# EAGLE design deska (EAGLE 9.5.0)
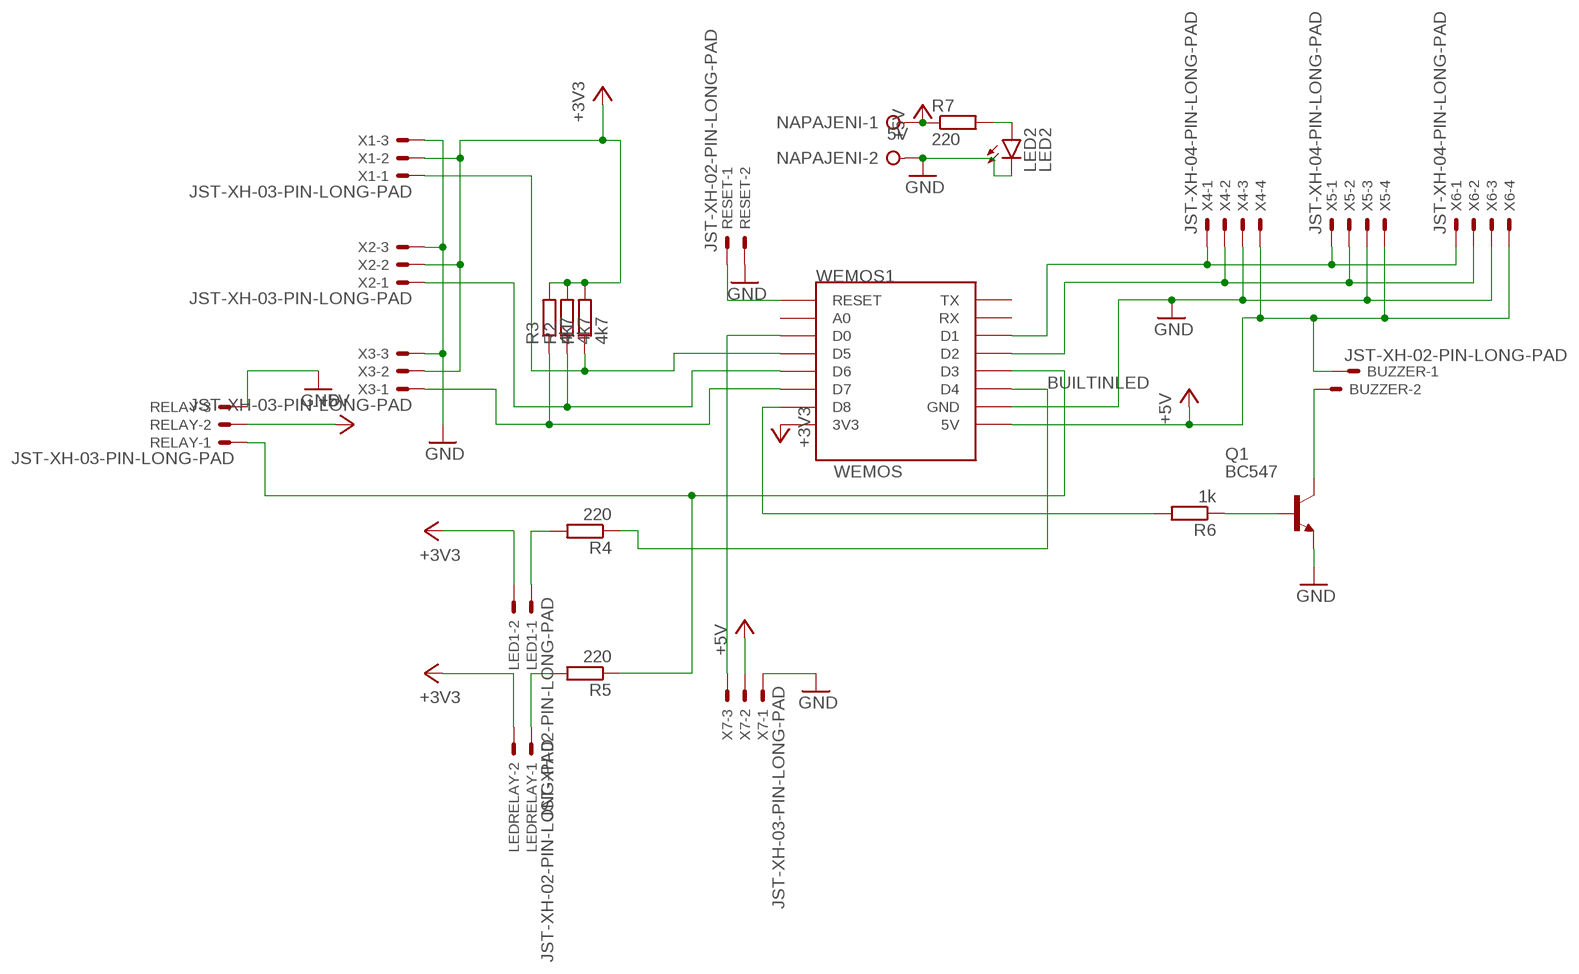
[diagram p0: schematic, sheet 1]

## Parts
BUZZER  JST-XH-02-PIN-LONG-PAD  [JST-XH-02-PACKAGE-LONG-PAD]
LED1  JST-XH-02-PIN-LONG-PAD  [JST-XH-02-PACKAGE-LONG-PAD]
LED2  LED2  LED3MM  [LED3MM]
LEDRELAY  JST-XH-02-PIN-LONG-PAD  [JST-XH-02-PACKAGE-LONG-PAD]
NAPAJENI  5V  W237-02P  [W237-132]
Q1  BC547  [TO92]
R1  4k7  R-EU_0207/7  [0207/7]
R2  4k7  R-EU_0207/7  [0207/7]
R3  4k7  R-EU_0207/7  [0207/7]
R4  220  R-EU_0207/7  [0207/7]
R5  220  R-EU_0207/7  [0207/7]
R6  1k  R-EU_0207/7  [0207/7]
R7  220  R-EU_0207/7  [0207/7]
RELAY  JST-XH-03-PIN-LONG-PAD  [JST-XH-03-PACKAGE-LONG-PAD]
RESET  JST-XH-02-PIN-LONG-PAD  [JST-XH-02-PACKAGE-LONG-PAD]
WEMOS1  WEMOS  WEMOS-D1-MINI  [WEMOS-D1-MINI]
X1  JST-XH-03-PIN-LONG-PAD  [JST-XH-03-PACKAGE-LONG-PAD]
X2  JST-XH-03-PIN-LONG-PAD  [JST-XH-03-PACKAGE-LONG-PAD]
X3  JST-XH-03-PIN-LONG-PAD  [JST-XH-03-PACKAGE-LONG-PAD]
X4  JST-XH-04-PIN-LONG-PAD  [JST-XH-04-PACKAGE-LONG-PAD]
X5  JST-XH-04-PIN-LONG-PAD  [JST-XH-04-PACKAGE-LONG-PAD]
X6  JST-XH-04-PIN-LONG-PAD  [JST-XH-04-PACKAGE-LONG-PAD]
X7  JST-XH-03-PIN-LONG-PAD  [JST-XH-03-PACKAGE-LONG-PAD]

## Nets
+3V3: LED1.2 LEDRELAY.2 R1.2 R2.2 R3.2 WEMOS1.3V3 X1.2 X2.2 X3.2
+5V: BUZZER.1 NAPAJENI.1 R7.1 RELAY.2 WEMOS1.5V X4.4 X5.4 X6.4 X7.2
BUILTINLED: R4.1 WEMOS1.D4
GND: LED2.K(C) NAPAJENI.2 Q1.1(E) RELAY.3 RESET.2 WEMOS1.GND X1.3 X2.3 X3.3 X4.3 X5.3 X6.3 X7.1
N$1: R1.1 WEMOS1.D5 X1.1
N$2: LEDRELAY.1 R5.2
N$4: LED2.A R7.2
N$5: RESET.1 WEMOS1.RESET
N$6: LED1.1 R4.2
N$7: Q1.2(B) R6.1
N$8: R6.2 WEMOS1.D8
N$9: R3.1 WEMOS1.D7 X3.1
N$10: WEMOS1.D0 X7.3
N$11: WEMOS1.D1 X4.1 X5.1 X6.1
N$12: WEMOS1.D2 X4.2 X5.2 X6.2
N$14: R5.1 RELAY.1 WEMOS1.D3
N$15: BUZZER.2 Q1.3(C)
N$19: R2.1 WEMOS1.D6 X2.1
Unconnected: WEMOS1.A0 WEMOS1.RX WEMOS1.TX

## Library data of the parts
BUZZER LED1 LEDRELAY RESET = Rembrandt Electronics - JST XH Connectors v1-0:JST-XH-02-PIN: JST XH Connector 2 Pin Wire to board connector. Pitch: 2,54 mm, (0.100") Number of pins: 2 Created by Rembrandt Electronics www.rembrandtelectronics.com
LED2 = led:LED: LED OSRAM: - CHIPLED LG R971, LG N971, LY N971, LG Q971, LY Q971, LO R971, LY R971 LH N974, LH R974 LS Q976, LO Q976, LY Q976 LO Q996 - Hyper CHIPLED LW Q18S LB Q993, LB Q99A, LB R99A - SideLED LS A670, LO A670, LY A670, LG A670, LP A670 LB A673, LV A673, LT A673, LW A673 LH A674 LY A675 LS A676, LA A676, LO A676, LY A676, LW A676 LS A679, LY A679, LG A679 - Hyper Micro SIDELED® LS Y876, LA Y876, LO Y876, LY Y876 LT Y87S - SmartLED LW L88C, LW L88S LB L89C, LB L89S, LG L890 LS L89K, LO L89K, LY L89K LS L896, LA L896, LO L896, LY L896 - TOPLED LS T670, LO T670, LY T670, LG T670, LP T670 LSG T670, LSP T670, LSY T670, LOP T670, LYG T670 LG T671, LOG T671, LSG T671 LB T673, LV T673, LT T673, LW T673 LH T674 LS T676, LA T676, LO T676, LY T676, LB T676, LH T676, LSB T676, LW T676 LB T67C, LV T67C, LT T67C, LS T67K, LO T67K, LY T67K, LW E67C LS E67B, LA E67B, LO E67B, LY E67B, LB E67C, LV E67C, LT E67C LW T67C LS T679, LY T679, LG T679 LS T770, LO T770, LY T770, LG T770, LP T770 LB T773, LV T773, LT T773, LW T773 LH T774 LS E675, LA E675, LY E675, LS T675 LS T776, LA T776, LO T776, LY T776, LB T776 LHGB T686 LT T68C, LB T68C - Hyper Mini TOPLED® LB M676 - Mini TOPLED Santana® LG M470 LS M47K, LO M47K, LY M47K Source: http://www.osram.convergy.de LUXEON: - LUMILED® LXK2-PW12-R00, LXK2-PW12-S00, LXK2-PW14-U00, LXK2-PW14-V00 LXK2-PM12-R00, LXK2-PM12-S00, LXK2-PM14-U00 LXK2-PE12-Q00, LXK2-PE12-R00, LXK2-PE12-S00, LXK2-PE14-T00, LXK2-PE14-U00 LXK2-PB12-K00, LXK2-PB12-L00, LXK2-PB12-M00, LXK2-PB14-N00, LXK2-PB14-P00, LXK2-PB14-Q00 LXK2-PR12-L00, LXK2-PR12-M00, LXK2-PR14-Q00, LXK2-PR14-R00 LXK2-PD12-Q00, LXK2-PD12-R00, LXK2-PD12-S00 LXK2-PH12-R00, LXK2-PH12-S00 LXK2-PL12-P00, LXK2-PL12-Q00, LXK2-PL12-R00 Source: www.luxeon.com KINGBRIGHT: KA-3528ASYC Source: www.kingbright.com
NAPAJENI = con-wago-508:W237-02P: WAGO SREW CLAMP; OC_FARNELL: unknown; OC_NEWARK: unknown
Q1 = transistor-npn:BC547*: NPN Transistor
R1-R7 = rcl:R-EU_: RESISTOR, European symbol
RELAY X1-X3 X7 = Rembrandt Electronics - JST XH Connectors v1-0:JST-XH-03-PIN: JST XH Connector 2 Pin Wire to board connector. Pitch: 2,54 mm, (0.100") Number of pins: 3 Created by Rembrandt Electronics www.rembrandtelectronics.com
WEMOS1 = wemos:WEMOS-D1-MINI: WeMos.cc D1 mini ESP8266 module
X4-X6 = Rembrandt Electronics - JST XH Connectors v1-0:JST-XH-04-PIN: JST XH Connector 2 Pin Wire to board connector. Pitch: 2,54 mm, (0.100") Number of pins: 4 Created by Rembrandt Electronics www.rembrandtelectronics.com

## Board
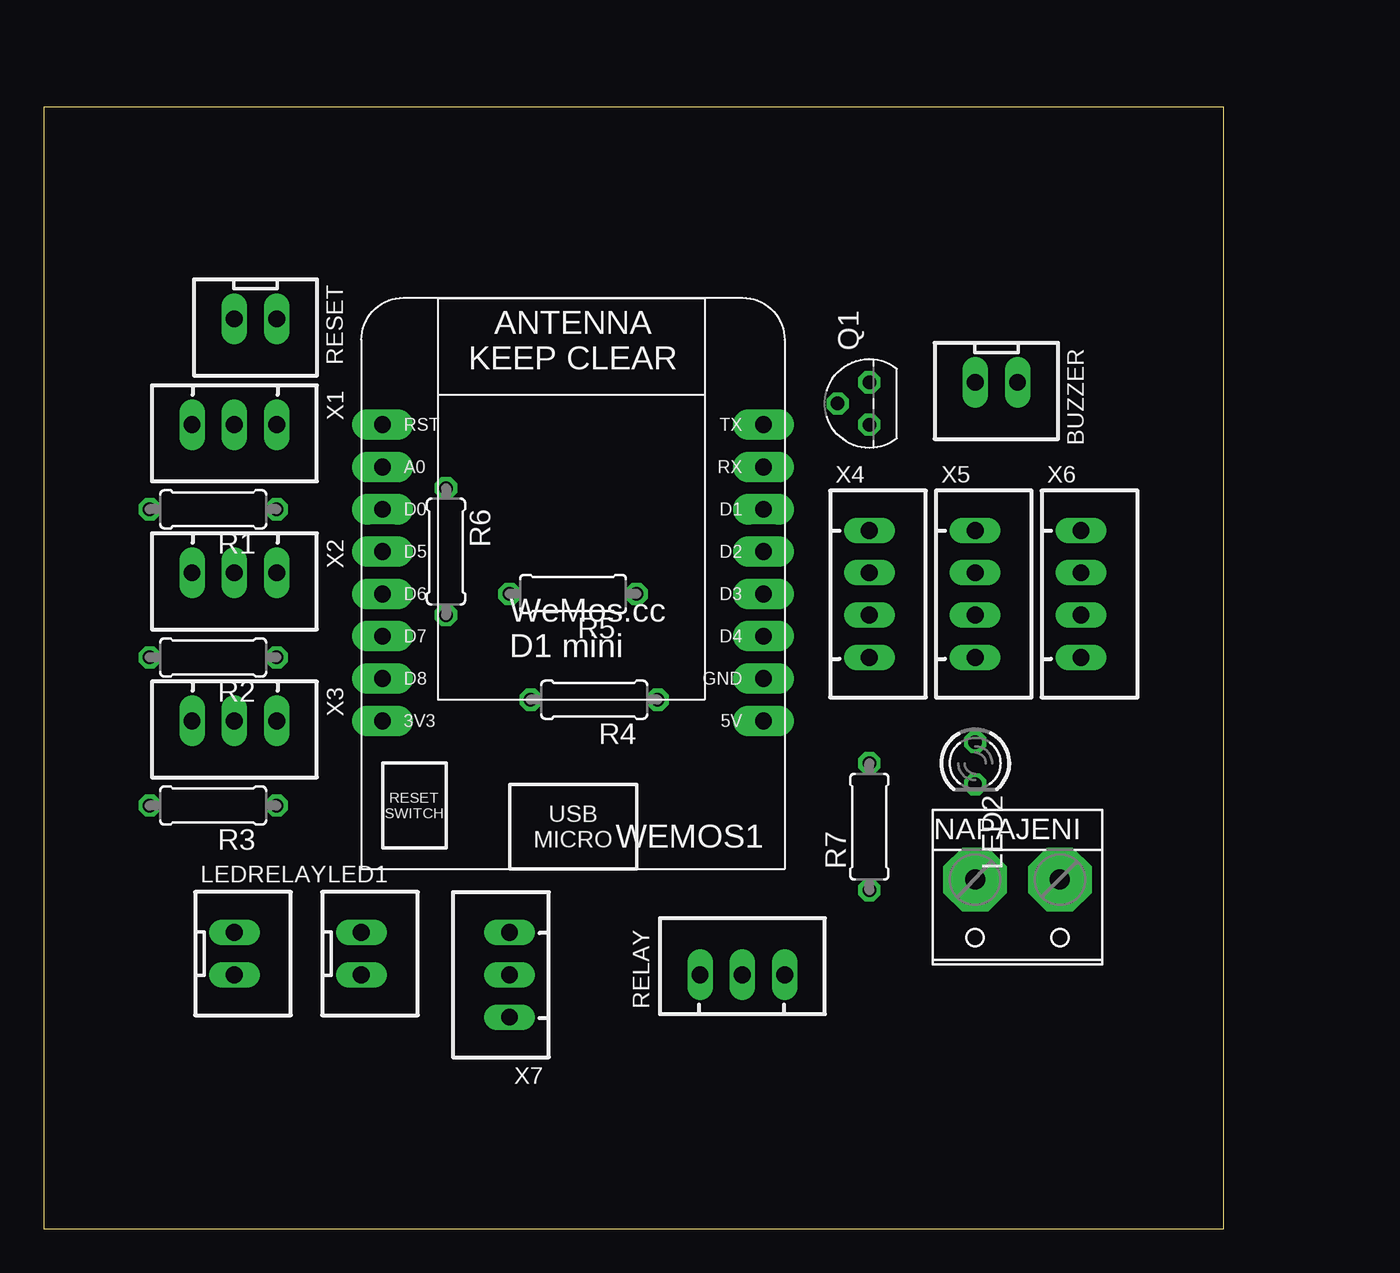
[diagram p1: board, top side]
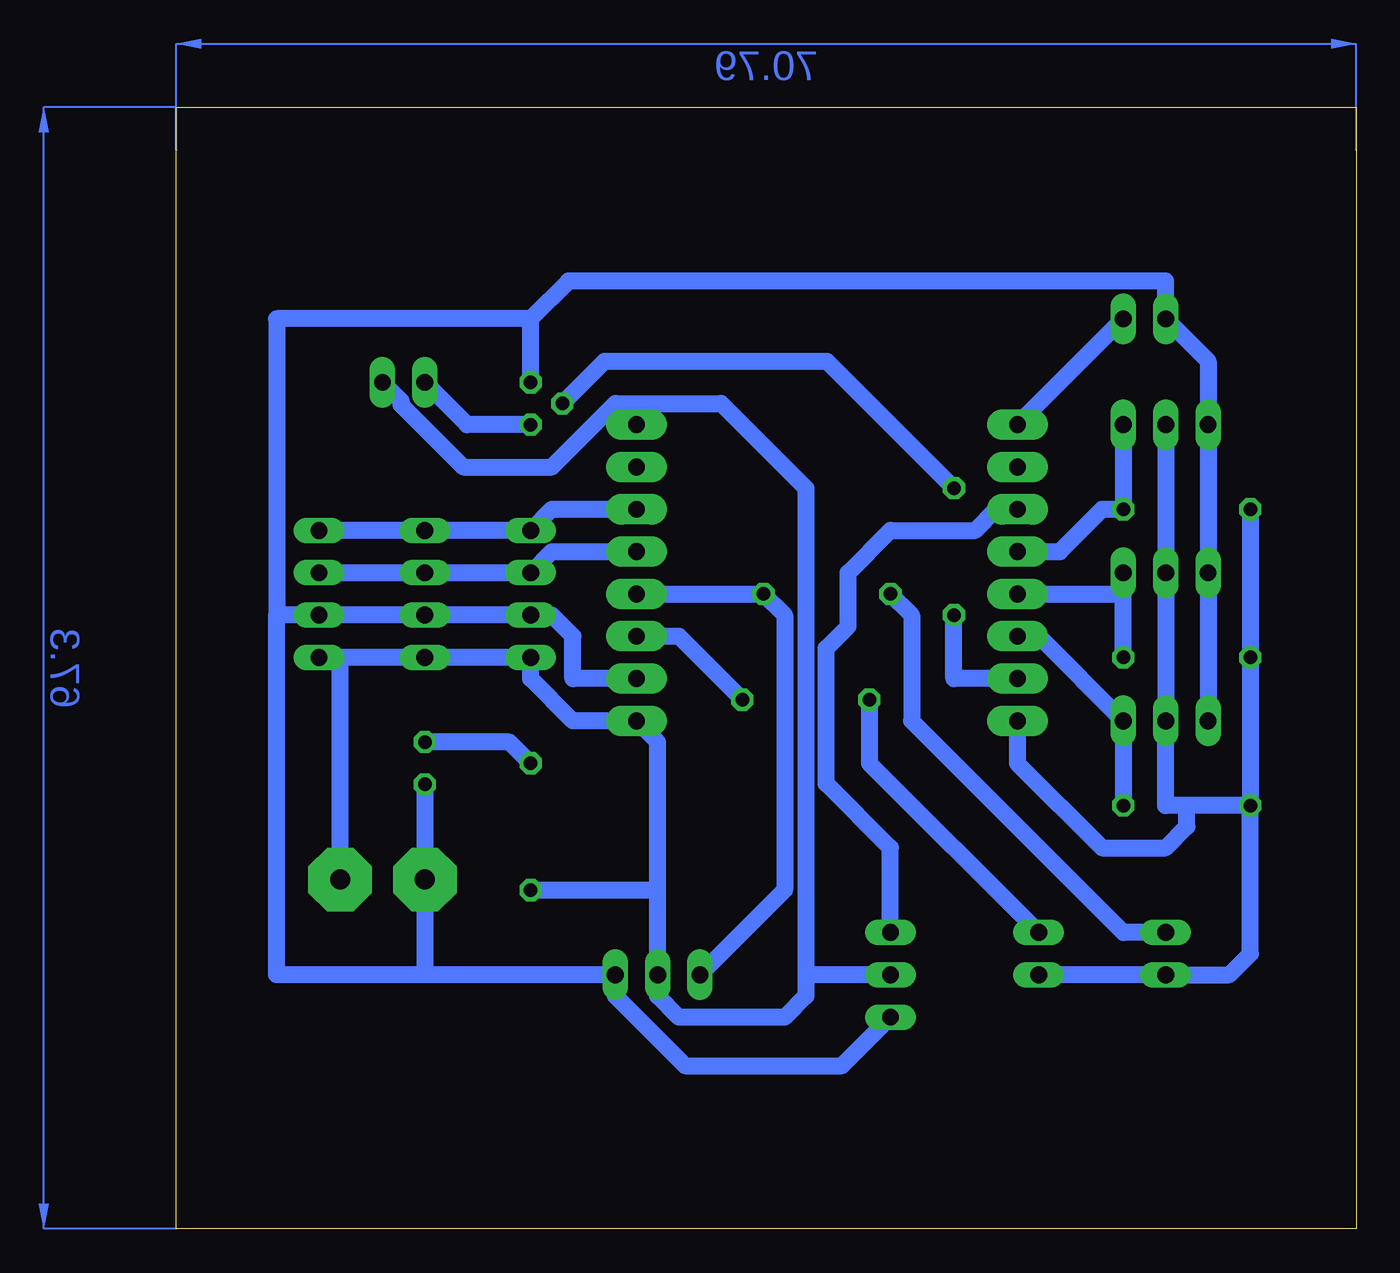
[diagram p2: board, bottom side, seen from below]

Size 70.79 x 67.3 mm. Coordinates in mm from the lower left corner, seen from the top.
Outline: 0,0 70.79,0 70.79,67.3 0,67.3 0,0
Copper layers (1*16): Top 0.035mm / dielectric 1.5mm / Bottom 0.035mm
Design rules "default": minimum track width 6mil, minimum drill 0.35mm, track to track 6mil, track to pad 6mil, pad to pad 6mil, via to via 6mil, smd to smd 6mil, copper to edge 40mil, drill to drill 6mil, minimum pad ring 10mil, minimum via ring 8mil, stop-mask expansion 4mil, vias tented up to drill 0mil, thermal gap 10mil

### Footprints (pad centres in the part's own frame; a part is rotated, then mirrored left to right if it is on the bottom)
JST-XH-02-PACKAGE-LONG-PAD = drill 1.016 long: 1 -1.27,0; 2 1.27,0
LED3MM = drill 0.813 octagon: A -1.27,0; K 1.27,0
W237-132 = drill 1.194 pad 3.81 octagon: 1 -2.54,-0.635; 2 2.54,-0.635
TO92 = drill 0.813 octagon: 1 1.27,0; 2 0,1.905; 3 -1.27,0
0207/7 = drill 0.813 octagon: 1 -3.81,0; 2 3.81,0
JST-XH-03-PACKAGE-LONG-PAD = drill 1.016 long: 1 -2.54,0; 2 0,0; 3 2.54,0
WEMOS-D1-MINI = drill 1.016 pad 1.829 long: 3V3 -10.16,-10.16; 5V 12.7,-10.16; A0 -10.16,5.08; D0 -10.16,2.54; D1 12.7,2.54; D2 12.7,0; D3 12.7,-2.54; D4 12.7,-5.08; D5 -10.16,0; D6 -10.16,-2.54; D7 -10.16,-5.08; D8 -10.16,-7.62; GND 12.7,-7.62; RESET -10.16,7.62; RX 12.7,5.08; TX 12.7,7.62
JST-XH-04-PACKAGE-LONG-PAD = drill 1.016 long: 1 -3.81,0; 2 -1.27,0; 3 1.27,0; 4 3.81,0

### Placement (x,y rotation side)
BUZZER  57.15,50.8 180 top
LED1  19.05,16.51 270 top
LED2  55.88,27.94 270 top
LEDRELAY  11.43,16.51 270 top
NAPAJENI  58.42,20.32 180 top
Q1  49.53,49.53 90 top
R1  10.16,43.18 180 top
R2  10.16,34.29 180 top
R3  10.16,25.4 180 top
R4  33.02,31.75 180 top
R5  31.75,38.1 180 top
R6  24.13,40.64 270 top
R7  49.53,24.13 90 top
RELAY  41.91,15.24 0 top
RESET  12.7,54.61 180 top
WEMOS1  30.48,40.64 0 top
X1  11.43,48.26 180 top
X2  11.43,39.37 180 top
X3  11.43,30.48 180 top
X4  49.53,38.1 270 top
X5  55.88,38.1 270 top
X6  62.23,38.1 270 top
X7  27.94,15.24 90 top

### Tracks (layer width: path | path; a pad name or v marks a point on that pad's centre or on a via)
+3V3
  Bottom 1.016: X1.2 X2.2 X3.2 11.43,25.4 10.16,25.4 | R3.2 10.16,25.4 | R1.2 R2.2 R3.2 | WEMOS1.3V3 20.32,27.94 15.24,22.86 11.43,22.86 10.16,24.13 10.16,25.4 | LEDRELAY.2 LED1.2 | 10.41,15.24 LEDRELAY.2 | LEDRELAY.2 7.62,15.24 6.35,16.51 R3.2
+5V
  Bottom 1.016: 60.96,34.29 X5.4 X4.4 49.53,33.02 46.99,30.48 WEMOS1.5V 41.91,29.21 41.91,20.32 | 60.96,34.29 X6.4 | 41.91,20.32 RELAY.2 41.91,13.97 40.64,12.7 34.29,12.7 33.02,13.97 33.02,15.24 | NAPAJENI.1 60.96,34.29 | R7.1 41.91,20.32 | BUZZER.1 57.3,49.68 57.3,49.45 53.57,45.72 48.26,45.72 44.45,49.53 38.1,49.53 33.02,44.45 33.02,15.24 | X7.2 33.02,15.24
BUILTINLED
  Bottom 1.016: WEMOS1.D4 40.64,35.56 R4.1
GND
  Bottom 1.016: X3.3 X2.3 X1.3 8.89,52.07 RESET.2 11.43,56.89 47.25,56.89 49.53,54.61 | LED2.K NAPAJENI.2 55.88,15.24 | 64.77,36.83 X6.3 X5.3 X4.3 48.26,36.83 46.99,35.56 46.99,33.02 WEMOS1.GND | 64.77,36.83 64.77,54.61 49.53,54.61 | Q1.1 49.53,54.61 | X7.1 30.86,9.78 40.26,9.78 44.45,13.97 RELAY.3 55.88,15.24 | 55.88,15.24 64.77,15.24 64.77,36.83
N$1
  Bottom 1.016: X1.1 R1.1 15.24,43.18 17.78,40.64 WEMOS1.D5
N$2
  Bottom 1.016: LEDRELAY.1 13.97,17.78 26.67,30.48 26.67,36.83 R5.2
N$4
  Bottom 1.016: R7.2 50.8,29.21 LED2.A
N$5
  Bottom 1.016: RESET.1 WEMOS1.RESET
N$6
  Bottom 1.016: LED1.1 29.21,27.94 R4.2
N$7
  Bottom 1.016: Q1.2 45.09,52.07 31.75,52.07 R6.1
N$8
  Bottom 1.016: WEMOS1.D8 24.13,33.02 R6.2
N$9
  Bottom 1.016: R3.1 X3.1 19.05,35.56 WEMOS1.D7
N$10
  Bottom 1.016: WEMOS1.D0 21.59,43.18 22.86,41.91 27.94,41.91 30.48,39.37 30.48,36.16 31.8,34.84 31.8,26.72 27.94,22.86 X7.3
N$11
  Bottom 1.016: WEMOS1.D1 48.26,43.18 X4.1 X5.1 X6.1
N$12
  Bottom 1.016: WEMOS1.D2 48.26,40.64 X4.2 X5.2 X6.2
N$14
  Bottom 1.016: WEMOS1.D3 R5.1 34.29,36.83 34.29,20.32 RELAY.1
N$15
  Bottom 1.016: Q1.3 53.34,48.26 BUZZER.2
N$19
  Bottom 1.016: R2.1 13.97,38.1 | 13.97,38.1 X2.1 | WEMOS1.D6 13.97,38.1
(copper drawn outside any net)
  shapes: Bottom area x2